# Altium schematic sheet Блок3.1.SchDoc
size A4; DocumentNumber: 8; SheetNumber: 8; SheetTotal: 12
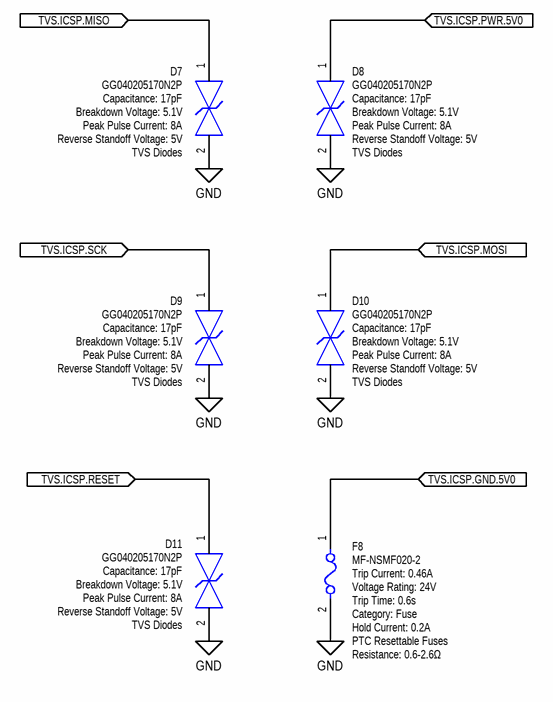
[diagram p0: Блок3.1.SchDoc]

## Parts
D7  GG040205170N2P  Capacitance: 17pF  Breakdown Voltage: 5.1V  Peak Pulse Current: 8A  Reverse Standoff Voltage: 5V  Device Class L2: TVS Diodes  [FP-GG0402-IPC_A]
D8  GG040205170N2P  Capacitance: 17pF  Breakdown Voltage: 5.1V  Peak Pulse Current: 8A  Reverse Standoff Voltage: 5V  Device Class L2: TVS Diodes  [FP-GG0402-IPC_A]
D9  GG040205170N2P  Capacitance: 17pF  Breakdown Voltage: 5.1V  Peak Pulse Current: 8A  Reverse Standoff Voltage: 5V  Device Class L2: TVS Diodes  [FP-GG0402-IPC_A]
D10  GG040205170N2P  Capacitance: 17pF  Breakdown Voltage: 5.1V  Peak Pulse Current: 8A  Reverse Standoff Voltage: 5V  Device Class L2: TVS Diodes  [FP-GG0402-IPC_A]
D11  GG040205170N2P  Capacitance: 17pF  Breakdown Voltage: 5.1V  Peak Pulse Current: 8A  Reverse Standoff Voltage: 5V  Device Class L2: TVS Diodes  [FP-GG0402-IPC_A]
F8  MF-NSMF020-2  Trip Current: 0.46A  Voltage Rating: 24V  Trip Time: 0.6s  Category: Fuse  Hold Current: 0.2A  Device Class L2: PTC Resettable Fuses  Resistance: 0.6-2.6Ω  [FP-MF-NSMF020-2-MFG]

## Ports
TVS.ICSP.GND.5V0 (in), TVS.ICSP.MISO (in), TVS.ICSP.MOSI (in), TVS.ICSP.PWR.5V0 (in), TVS.ICSP.RESET (in), TVS.ICSP.SCK (in)

## Nets
GND: D7.2 D8.2 D9.2 D10.2 D11.2 F8.2
TVS.ICSP.GND.5V0: F8.1 ; port TVS.ICSP.GND.5V0
TVS.ICSP.MISO: D7.1 ; port TVS.ICSP.MISO
TVS.ICSP.MOSI: D10.1 ; port TVS.ICSP.MOSI
TVS.ICSP.PWR.5V0: D8.1 ; port TVS.ICSP.PWR.5V0
TVS.ICSP.RESET: D11.1 ; port TVS.ICSP.RESET
TVS.ICSP.SCK: D9.1 ; port TVS.ICSP.SCK

## Library data of the parts
D7-D11 = CMP-04587-000002-1: TVS DIODE 5V 10V 0402; Manufacturer: AVX; Peak Pulse Power: 80W; Value: 17pF; Number Of Channels: 1; Direction: Bidirectional; Manufacturer Part Number: GG040205170N2P; Temperature: -55°C to +125°C; Octopart: https://octopart.com/gg040205170n2p-avx-81066082; RoHS: TRUE; Clamping Voltage: 10V; Device Class L1: Circuit Protection; ComponentLink2Description: Datasheet; Category: Diode; Package: GG0402; Temperature Range High: +125°C; Digikey Description: TVS DIODE 5V 10V 0402; Ipc Land Pattern Name: DIOC10060X50; Device Class L3: unset; Automotive: No; Mouser Description: ESD Suppressor TVS Bi-Dir 5V 2-Pin Case 0402(1006Metric) T/R; ComponentLink2URL: http://datasheets.avx.com/AVX-GiGuard.pdf; Height: 0.55mm; Lead Free: Yes; Temperature Range Low: -55°C
F8 = CMP-07400-000029-1: PTC RESET FUSE 24V 200MA 1206; Manufacturer: Bourns; Current Rating: 10A; Automotive Grade: Grade 3; Value: 0.6-2.6Ω; Ambient Temperature Range Low: -40°C; Device Class L1: Circuit Protection; Temperature Range Low: -40°C; Temperature: -40°C to +85°C; Temperature Range High: +85°C; Mouser Description: Resettable Fuses - PPTC 0.20A 24V 0.60ohm MAX (R); Device Class L3: unset; RoHS: TRUE; Package: MF-NSMF020-2; Ambient Temperature Range High: +85°C; ComponentLink2Description: Datasheet; Digikey Description: PTC RESET FUSE 24V 200MA 1206; Manufacturer Part Number: MF-NSMF020-2; Octopart: https://octopart.com/mf-nsmf020-2-bourns-94649; Automotive: Yes; Height: 0.85mm; Lead Free: Yes; ComponentLink2URL: https://www.bourns.com/docs/Product-Datasheets/mfnsmf.pdf